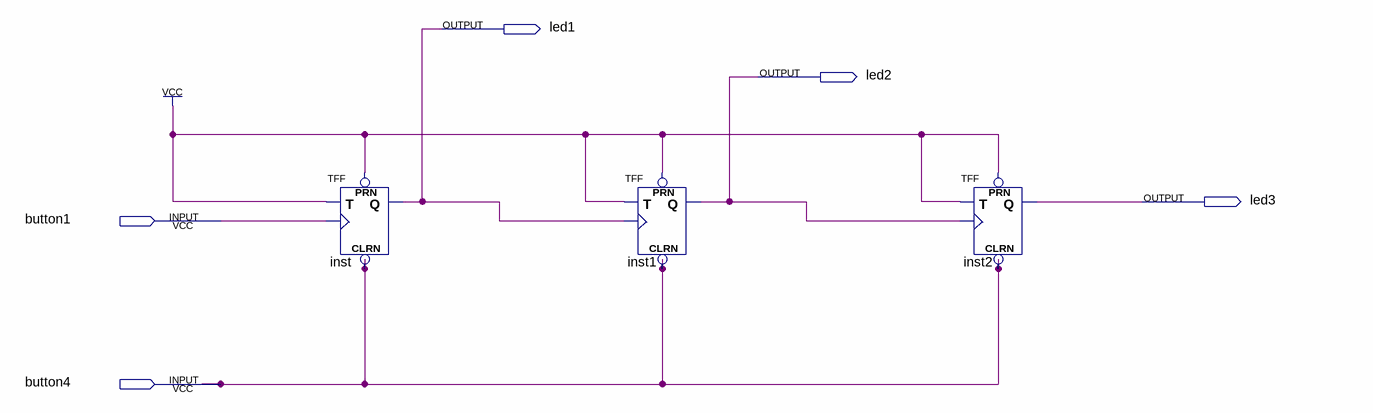
[diagram p0: schematic sheet]
// Quartus schematic Counter_3bit_AsyDown.bdf as structural Verilog: 3 symbols, 5 pins
module Counter_3bit_AsyDown (
  input  button1,
  input  button4,
  output led1,
  output led2,
  output led3
);

  TFF inst (.PRN(1'b1), .CLRN(button4), .T(1'b1), .CLK(button1), .Q(led1));
  TFF inst1 (.PRN(1'b1), .CLRN(button4), .T(1'b1), .CLK(led1), .Q(led2));
  TFF inst2 (.PRN(1'b1), .CLRN(button4), .T(1'b1), .CLK(led2), .Q(led3));
endmodule
